# Altium schematic sheet [01] - COVER PAGE.SchDoc
size A3; DocumentNumber: 1; SheetNumber: 1; SheetTotal: 4
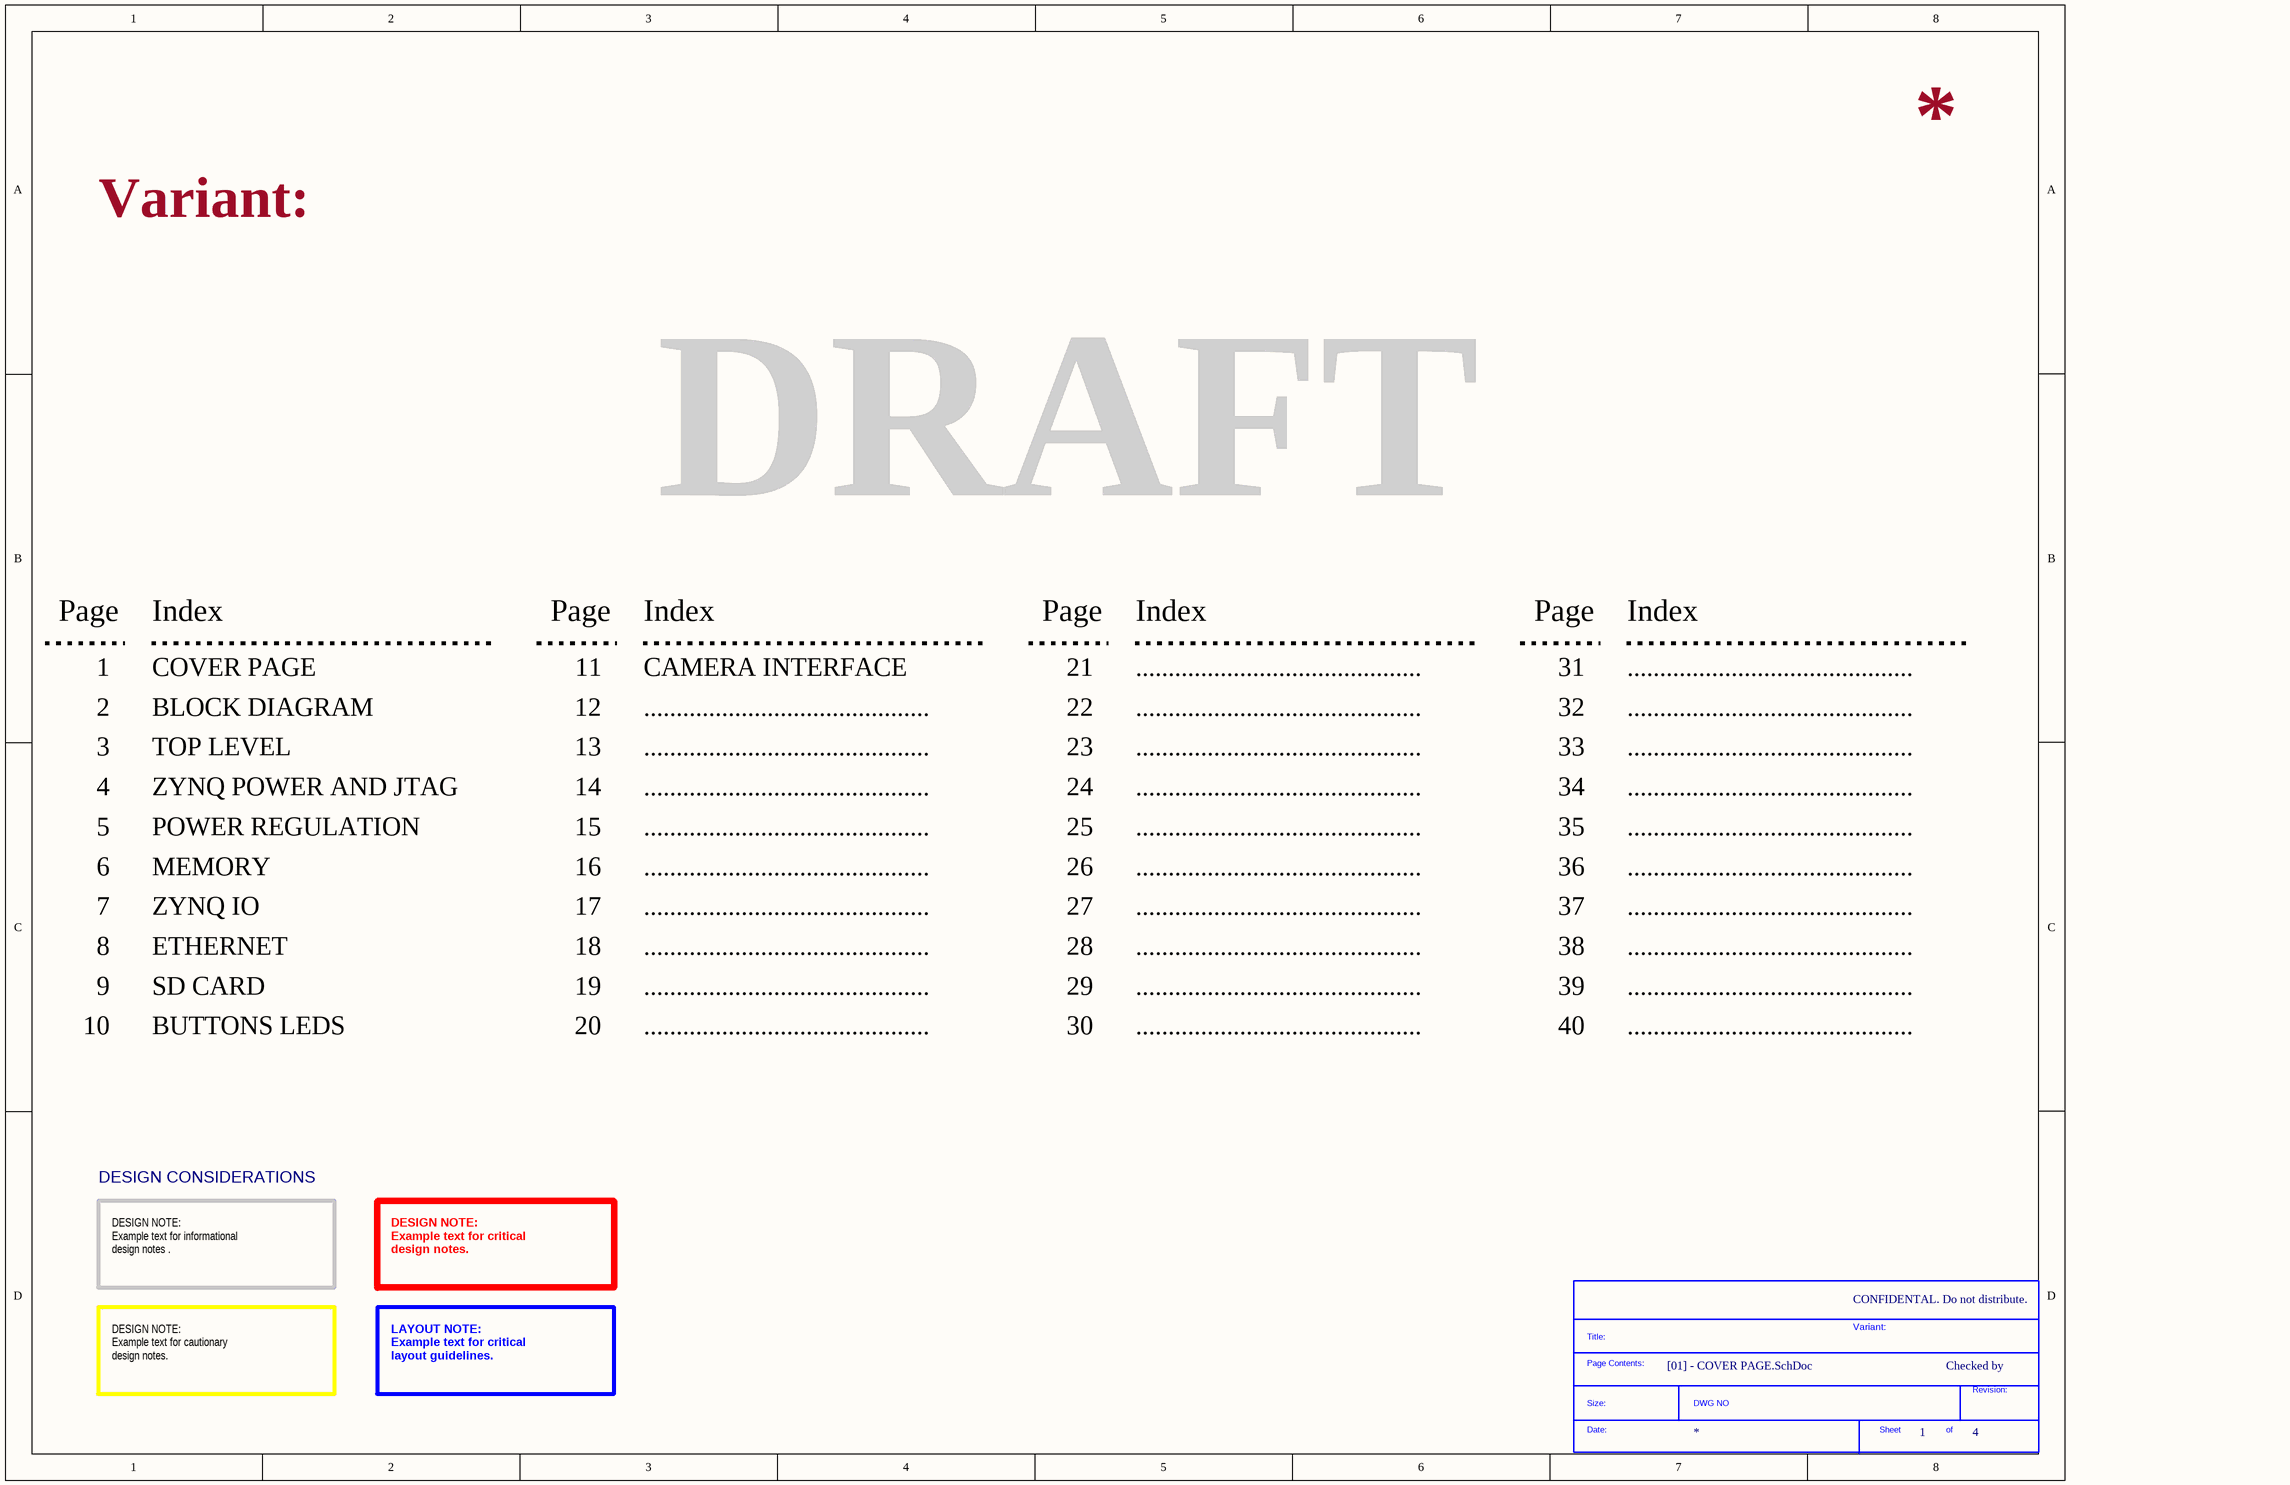
[diagram p0: [01] - COVER PAGE.SchDoc]

## Parts
*  SDTitleBlock  (value not drawn)  (graphical)

## Notes on the sheet
- Variant:
- DRAFT
- Page
- Index
- 1
- COVER PAGE
- 11
- CAMERA INTERFACE
- 21
- ............................................
- 31
- 2
- 3
- BLOCK DIAGRAM
- TOP LEVEL
- 12
- 13
- 22
- 23
- 32
- 33
- 4
- 5
- ZYNQ POWER AND JTAG
- POWER REGULATION
- 14
- 15
- 24
- 25
- 34
- 35
- 6
- MEMORY
- 16
- 26
- 36
- 7
- 8
- ZYNQ IO
- ETHERNET
- 17
- 18
- 27
- 28
- 37
- 38
- 9
- 10
- SD CARD
- BUTTONS LEDS
- 19
- 20
- 29
- 30
- 39
- 40
- DESIGN CONSIDERATIONS
- DESIGN NOTE:
  Example text for informational
  design notes .
- DESIGN NOTE:
  Example text for critical
  design notes.
- CONFIDENTAL. Do not distribute.
- Checked by
- DESIGN NOTE:
  Example text for cautionary
  design notes.
- LAYOUT NOTE:
  Example text for critical
  layout guidelines.
- (in symbol SDTitleBlock) Title:; Page Contents:; Revision:; Size:; DWG NO; Date:; Sheet; of